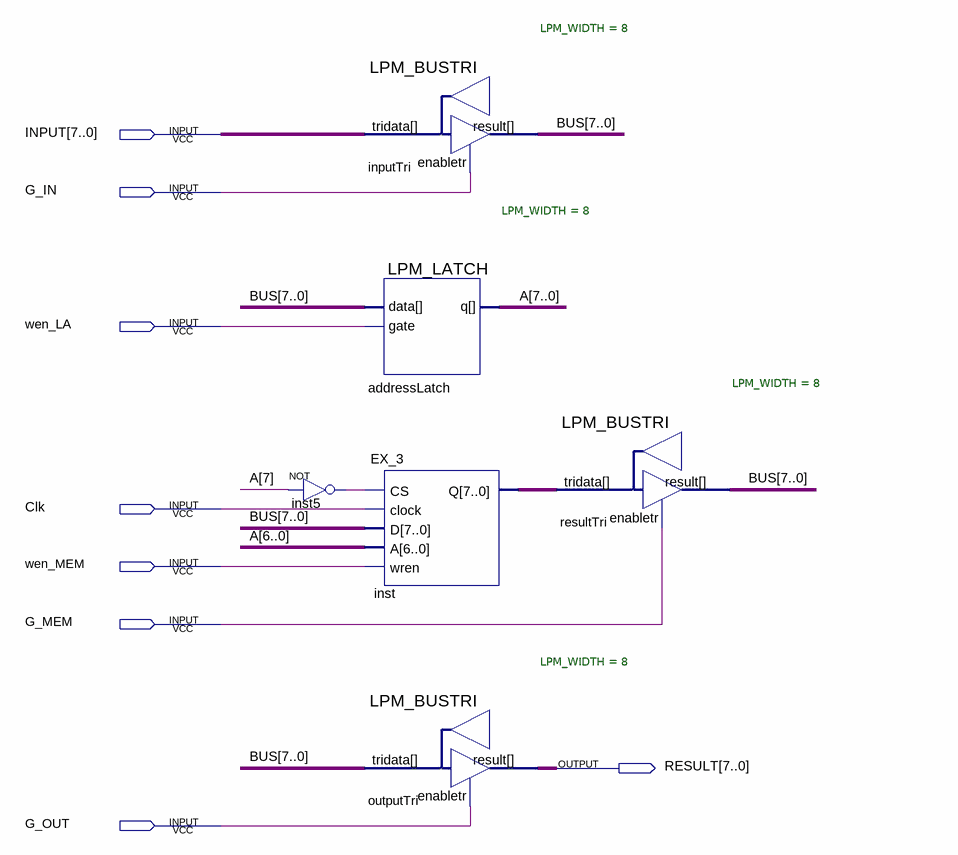
[diagram p0: schematic sheet]
// Quartus schematic EX_3_1.bdf as structural Verilog: 6 symbols, 8 pins
module EX_3_1 (
  input  [7:0] INPUT,
  input  G_IN,
  input  wen_LA,
  input  Clk,
  input  wen_MEM,
  input  G_MEM,
  input  G_OUT,
  output [7:0] RESULT
);

  wire inst5_out;
  wire [7:0] A, BUS, inst_q;

  not inst5 (inst5_out, A[7]);
  LPM_BUSTRI #(.LPM_WIDTH(8)) inputTri (.enabletr(G_IN), .result(BUS), .tridata(INPUT));
  LPM_LATCH #(.LPM_WIDTH(8)) addressLatch (.data(BUS), .gate(wen_LA), .q(A));
  EX_3 inst (.CS(inst5_out), .clock(Clk), .D(BUS), .A(A[6:0]), .wren(wen_MEM), .Q(inst_q));
  LPM_BUSTRI #(.LPM_WIDTH(8)) outputTri (.enabletr(G_OUT), .result(RESULT), .tridata(BUS));
  LPM_BUSTRI #(.LPM_WIDTH(8)) resultTri (.enabletr(G_MEM), .result(BUS), .tridata(inst_q));
endmodule
